# EAGLE design module_CC1101 (EAGLE 9.4.1)
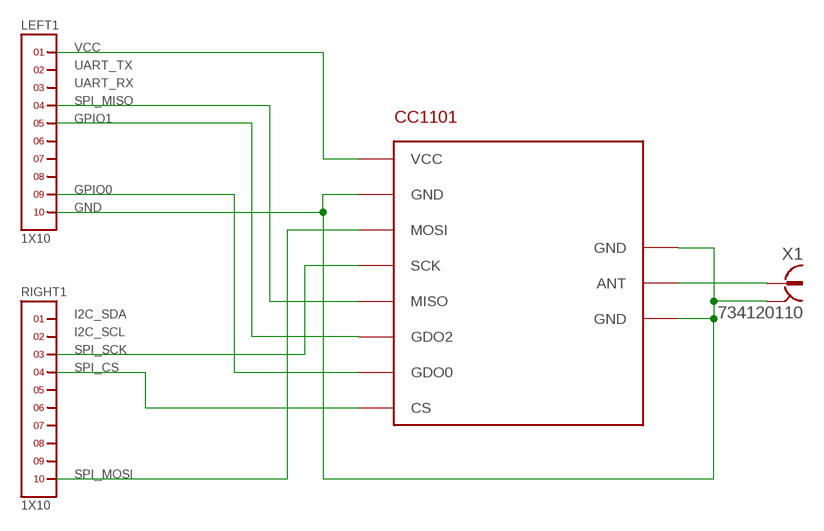
[diagram p0: schematic, sheet 1]

## Parts
CC1101  CC1101  [CC1101]
LEFT1  1X10  [1X10]
RIGHT1  1X10  [1X10]
X1  734120110  [734120110]

## Nets
GND: CC1101.GND@1(GND) CC1101.GND@2(GND) CC1101.GND@3(GND) LEFT1.10 X1.S@1 X1.S@2 X1.S@3
INT0: CC1101.GDO0 LEFT1.9
INT1: CC1101.GDO2 LEFT1.5
N$1: CC1101.ANT X1.1
SPI_CS: CC1101.CS RIGHT1.4
SPI_MISO: CC1101.MISO LEFT1.4
SPI_MOSI: CC1101.MOSI RIGHT1.10
SPI_SCK: CC1101.SCK RIGHT1.3
VCC: CC1101.VCC LEFT1.1
Unconnected: LEFT1.2 LEFT1.3 LEFT1.6 LEFT1.7 LEFT1.8 RIGHT1.1 RIGHT1.2 RIGHT1.5 RIGHT1.6 RIGHT1.7 RIGHT1.8 RIGHT1.9

## Notes on the sheet
- VCC
- UART_TX
- UART_RX
- SPI_MISO
- GPIO1
- GPIO0
- GND
- I2C_SDA
- I2C_SCL
- SPI_SCK
- SPI_CS
- SPI_MOSI

## Library data of the parts
CC1101 = RadioShield:CC1101
LEFT1 RIGHT1 = headers(2mm):1X10
X1 = con-coax:734120110: MICRO COAXIAL CONNECTOR RECEPTACLE VERTICAL Source: Data sheet <http://www.molex.com/pdm_docs/sd/734120110_sd.pdf>

## Board
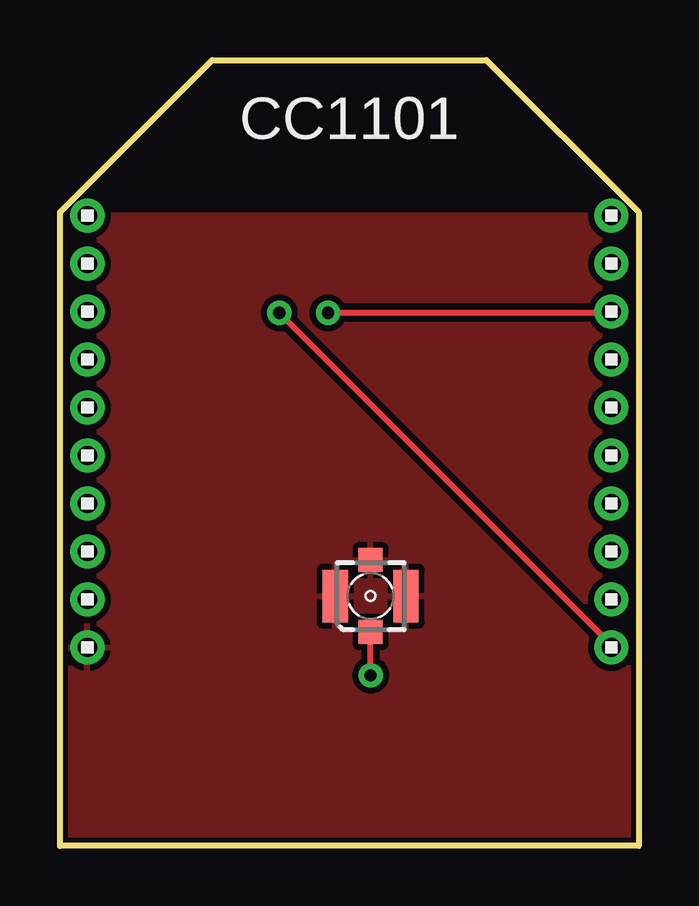
[diagram p1: board, top side]
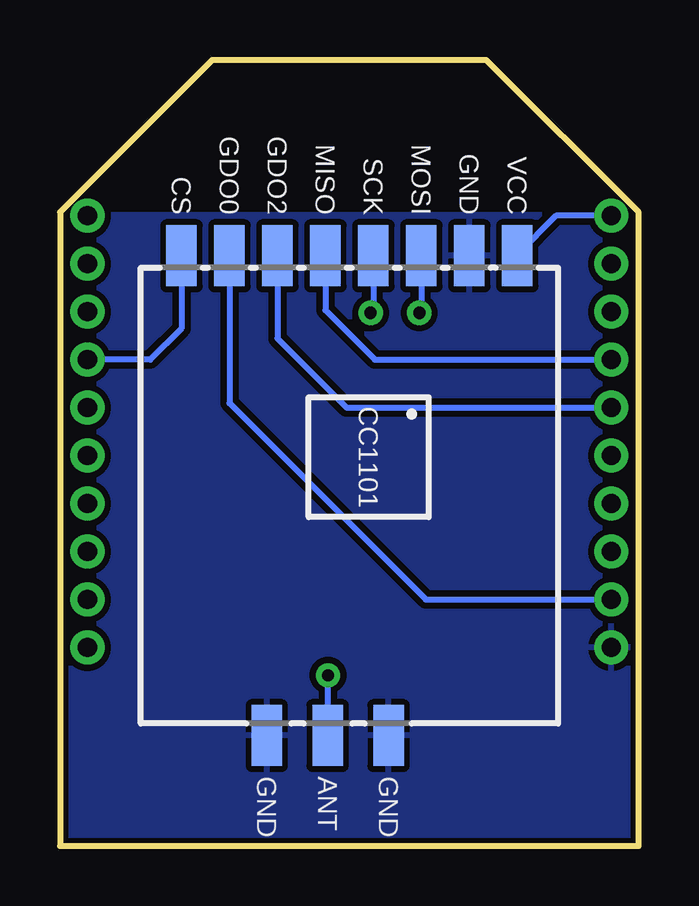
[diagram p2: board, bottom side, seen from below]

Size 24.13 x 32.77 mm. Coordinates in mm from the lower left corner, seen from the top.
Outline: 0,0 0,26.42 6.35,32.77 17.78,32.77 24.13,26.42 24.13,0 0,0
Copper layers (1*16): Top 0.035mm / dielectric 1.5mm / Bottom 0.035mm
Design rules "SparkFun-2-layer-STANDARD": minimum track width 10mil, minimum drill 20mil, track to track 10mil, track to pad 8mil, pad to pad 8mil, via to via 10mil, smd to smd 8mil, copper to edge 8mil, drill to drill 8mil, minimum pad ring 10mil, minimum via ring 10mil, stop-mask expansion 4mil, vias tented up to drill 25mil, thermal gap 10mil

### Footprints (pad centres in the part's own frame; a part is rotated, then mirrored left to right if it is on the bottom)
CC1101 = smd 2.54 x 1.27: ANT 10,-0.9; CS -10,-7; GDO0 -10,-5; GDO2 -10,-3; GND@1 -10,5; GND@2 10,1.64; GND@3 10,-3.44; MISO -10,-1; MOSI -10,3; SCK -10,1; VCC -10,7
1X10 = drill 0.8 pad 1.422: 1 -9,0; 2 -7,0; 3 -5,0; 4 -3,0; 5 -1,0; 6 1,0; 7 3,0; 8 5,0; 9 7,0; 10 9,0
734120110 = smd 1 x 1: 1 0,-1.5; S@1 0,1.5 | smd 1.05 x 2.2: S@2 -1.475,0; S@3 1.475,0

### Placement (x,y rotation side)
CC1101  12.06,14.6 270 bottom
LEFT1  1.14,17.27 270 top
RIGHT1  22.99,17.27 270 top
X1  12.95,10.41 0 top

### Tracks (layer width: path | path; a pad name or v marks a point on that pad's centre or on a via)
GND
  pour Bottom: -0.51,-0.51 -0.51,26.29 24.64,26.29 24.64,-0.51
  pour Top: -0.25,-0.25 -0.25,26.29 24.38,26.29 24.38,-0.25
INT0
  Bottom 0.254: LEFT1.9 8.88,10.27 17.07,18.46 CC1101.GDO0
INT1
  Bottom 0.254: LEFT1.5 12.18,18.27 15.06,21.16 CC1101.GDO2
N$1  (via drill 0.51)
  Top 0.254: v12.95,7.11 X1.1
  Bottom 0.254: CC1101.ANT 12.95,4.62 v12.95,7.11
SPI_CS
  Bottom 0.254: RIGHT1.4 20.37,20.27 19.07,21.58 CC1101.CS
SPI_MISO
  Bottom 0.254: LEFT1.4 11,20.27 13.06,22.34 CC1101.MISO
SPI_MOSI  (via drill 0.51)
  Top 0.254: v9.14,22.23 22.99,8.38 RIGHT1.10
  Bottom 0.254: CC1101.MOSI 9.06,22.3 v9.14,22.23
SPI_SCK  (via drill 0.51)
  Top 0.254: v11.18,22.23 22.94,22.23 RIGHT1.3
  Bottom 0.254: CC1101.SCK 11.06,22.34 v11.18,22.23
VCC
  Bottom 0.254: LEFT1.1 3.45,26.27 5.07,24.65 CC1101.VCC

### Text on the board
tNames: CC1101